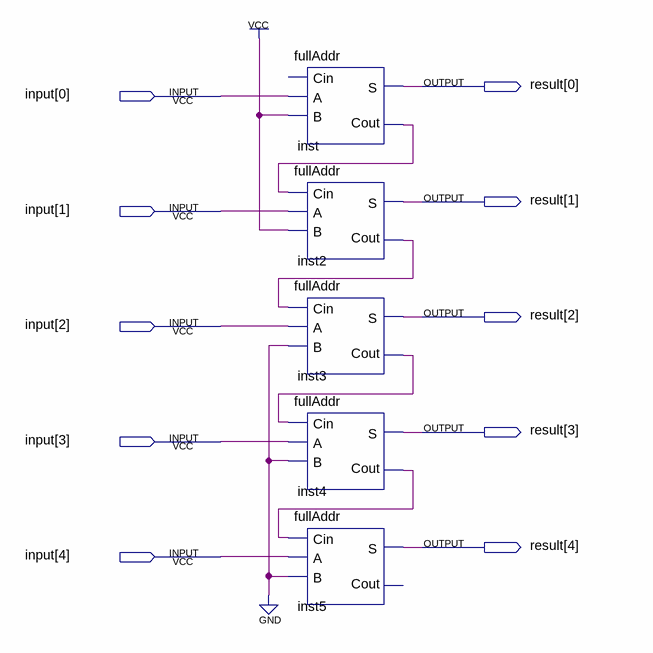
[diagram p0: schematic sheet]
// Quartus schematic math5bitAdd3.bdf as structural Verilog: 5 symbols, 10 pins
module math5bitAdd3 (
  input  [4:0] \input ,
  output [4:0] result
);

  wire inst2_cout, inst3_cout, inst4_cout, inst_cout;

  fullAddr inst (.A(\input [0]), .B(1'b1), .Cout(inst_cout), .S(result[0]));  // open: Cin
  fullAddr inst2 (.A(\input [1]), .B(1'b1), .Cin(inst_cout), .Cout(inst2_cout), .S(result[1]));
  fullAddr inst3 (.A(\input [2]), .B(1'b0), .Cin(inst2_cout), .Cout(inst3_cout), .S(result[2]));
  fullAddr inst4 (.A(\input [3]), .B(1'b0), .Cin(inst3_cout), .Cout(inst4_cout), .S(result[3]));
  fullAddr inst5 (.A(\input [4]), .B(1'b0), .Cin(inst4_cout), .S(result[4]));  // open: Cout
endmodule
